# EAGLE design Pro_RF (EAGLE 9.1.0)
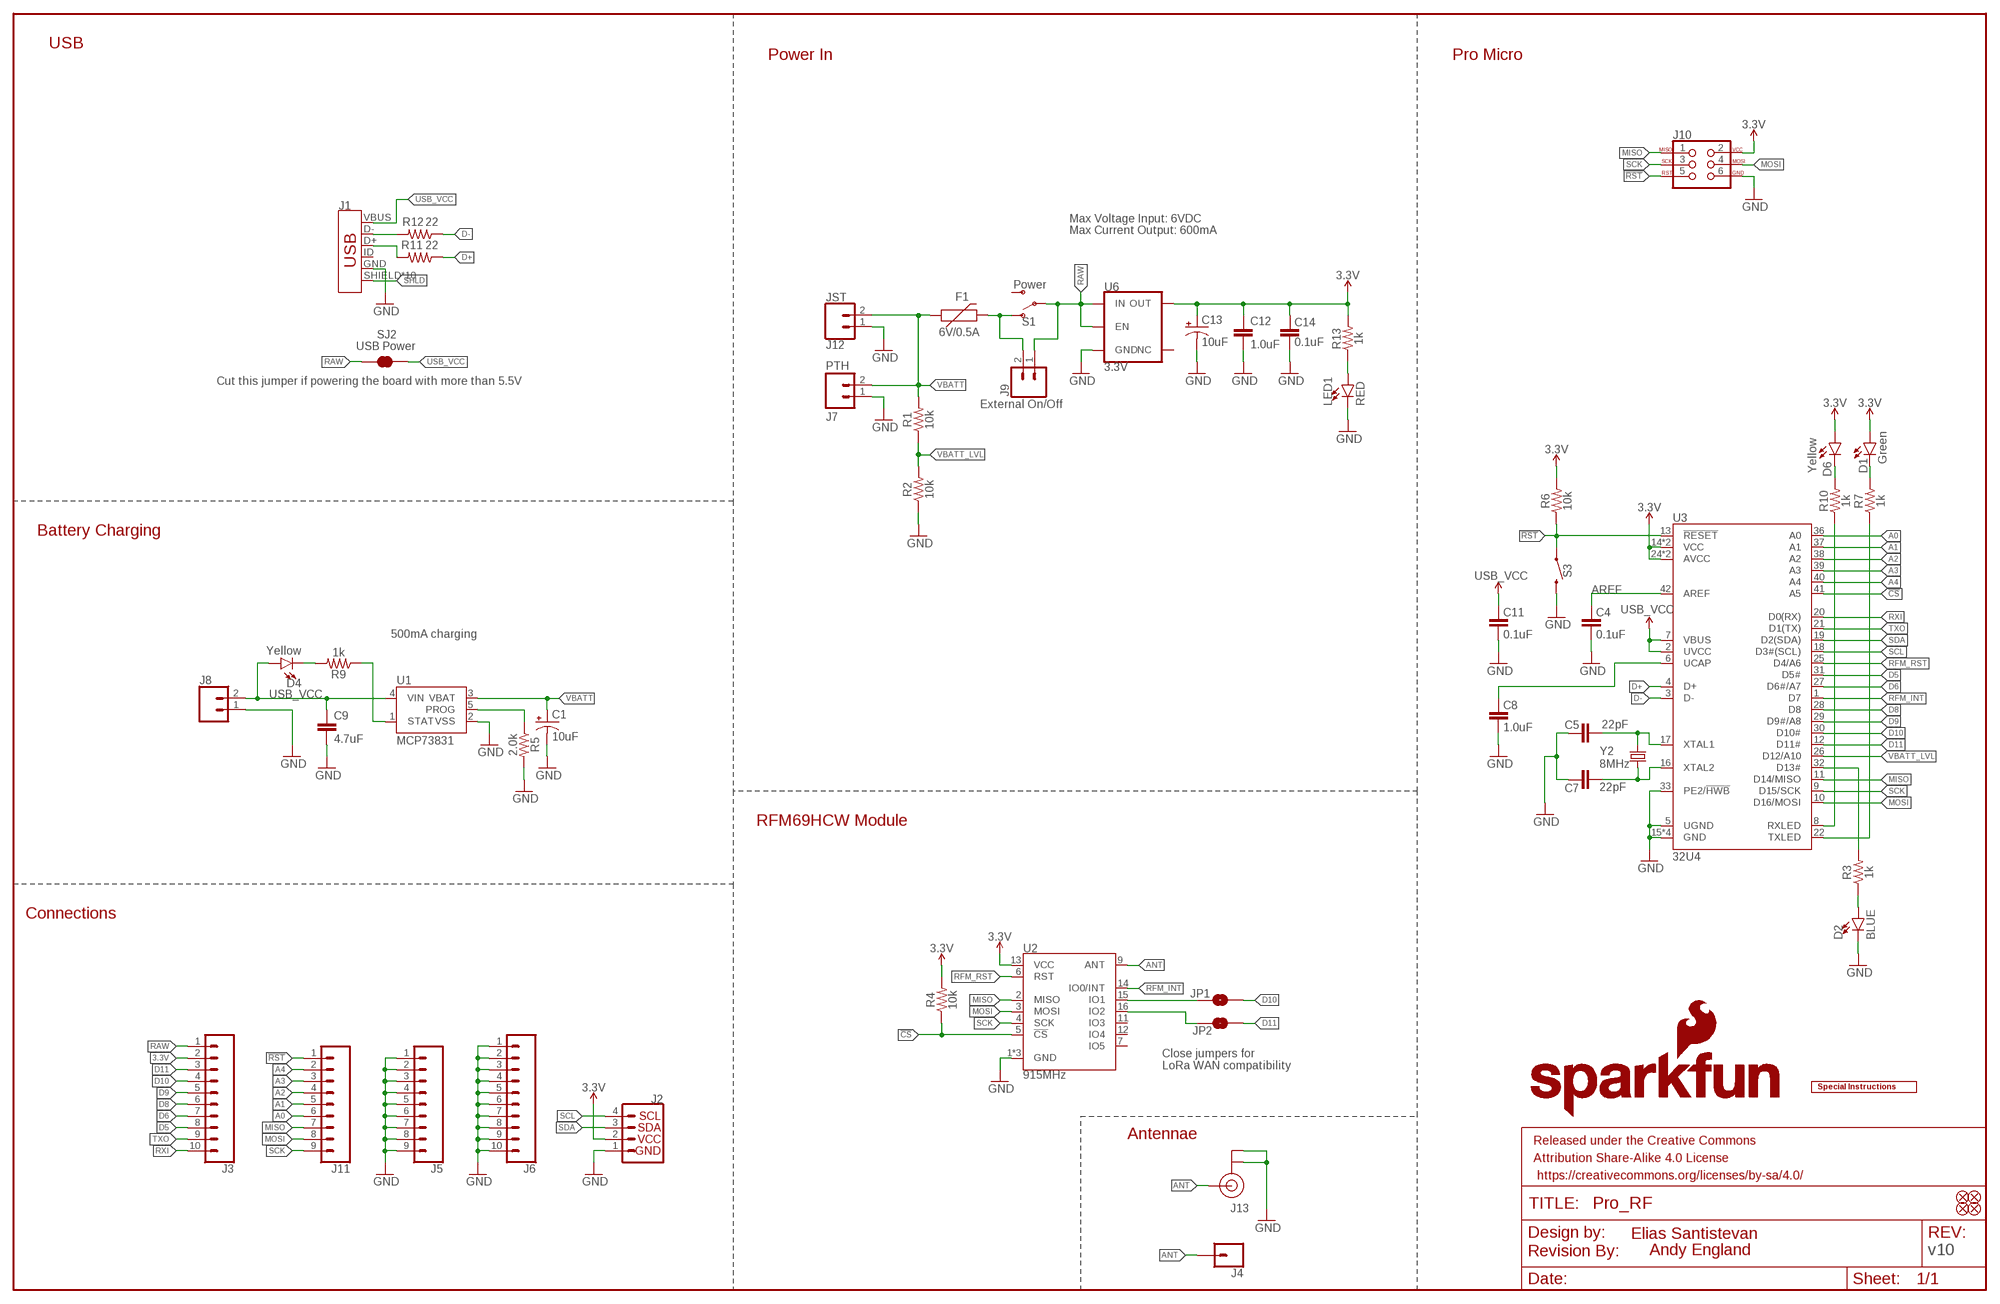
[diagram p0: schematic, sheet 1]

## Parts
C1  10uF  10UF-POLAR-EIA3216-16V-10%(TANT)  [EIA3216]
C4  0.1uF  0.1UF-0603-25V-(+80/-20%)  [0603]
C5  22pF  22PF-0603-50V-5%  [0603]
C7  22pF  22PF-0603-50V-5%  [0603]
C8  1.0uF  1.0UF-0603-16V-10%  [0603]
C9  4.7uF  4.7UF-0603-6.3V-(10%)  [0603]
C11  0.1uF  0.1UF-0603-25V-(+80/-20%)  [0603]
C12  1.0uF  1.0UF-0603-16V-10%  [0603]
C13  10uF  10UF-POLAR-EIA3216-16V-10%(TANT)  [EIA3216]
C14  0.1uF  0.1UF-0603-25V-(+80/-20%)  [0603]
D1  Green  LED-GREEN0603  [LED-0603]
D2  BLUE  LED-BLUE0603  [LED-0603]
D4  Yellow  LED-YELLOW0603  [LED-0603]
D6  Yellow  LED-YELLOW0603  [LED-0603]
F1  6V/0.5A  PPTC_HALF-AMP  [1206]
FD1  FIDUCIAL1X2  [FIDUCIAL-1X2]
FD2  FIDUCIAL1X2  [FIDUCIAL-1X2]
FD3  FIDUCIAL1X2  [FIDUCIAL-1X2]
FD4  FIDUCIAL1X2  [FIDUCIAL-1X2]
FRAME2  FRAME-LEDGER  [CREATIVE_COMMONS]
J1  USB_MICRO-B_HALF_PTH_MILL  [USB-MICROB-PTH-MILL]
J2  QWIIC_CONNECTORJS-1MM  [1X04_1MM_RA]
J3  CONN_10NO_SILK_PTH_FEMALE  [1X10_NO_SILK]
J4  CONN_01PTH_NO_SILK_YES_STOP  [1X01_NO_SILK]
J5  CONN_09NO_SILK  [1X09_NO_SILK]
J6  CONN_10NO_SILK_PTH_FEMALE  [1X10_NO_SILK]
J7  PTH  CONN_021X02_NO_SILK  [1X02_NO_SILK]
J8  CONN_021X02_NO_SILK  [1X02_NO_SILK]
J9  External On/Off  CONN_021X02_NO_SILK  [1X02_NO_SILK]
J10  AVR_SPI_PROG_3X2TESTPOINTS  [2X3_TEST_POINTS]
J11  CONN_09NO_SILK  [1X09_NO_SILK]
J12  JST  CONN_02-JST-2MM-SMT  [JST-2-SMD]
J13  U.FL  [U.FL]
JP1  JUMPER-SMT_2_NO_SILK  [SMT-JUMPER_2_NO_SILK]
JP2  JUMPER-SMT_2_NO_SILK  [SMT-JUMPER_2_NO_SILK]
LED1  RED  LED-RED0603  [LED-0603]
LOGO1  REVISION  [REVISION]
LOGO2  SFE_LOGO_NAME.1_INCH  [SFE_LOGO_NAME_.1]
LOGO3  SFE_LOGO_NAME_FLAME.1_INCH  [SFE_LOGO_NAME_FLAME_.1]
R1  10k  10KOHM-0603-1/10W-1%  [0603]
R2  10k  10KOHM-0603-1/10W-1%  [0603]
R3  1k  1KOHM-0603-1/10W-1%  [0603]
R4  10k  10KOHM-0603-1/10W-1%  [0603]
R5  2.0k  2.0KOHM-0603-1/10W-5%  [0603]
R6  10k  10KOHM-0603-1/10W-1%  [0603]
R7  1k  1KOHM-0603-1/10W-1%  [0603]
R9  1k  1KOHM-0603-1/10W-1%  [0603]
R10  1k  1KOHM-0603-1/10W-1%  [0603]
R11  22  22OHM-0603-1/10W-1%  [0603]
R12  22  22OHM-0603-1/10W-1%  [0603]
R13  1k  1KOHM-0603-1/10W-1%  [0603]
S1  Power  SWITCH-SPDT-SMD-RIGHT-ANGLE  [SWITCH_SPST_SMD_A]
S3  MOMENTARY-SWITCH-SPST-SMD-RIGHT-ANGLE  [TACTILE_SWITCH_SMD_RIGHT_ANGLE]
SJ2  USB Power  JUMPER-SMT_2_NC_TRACE_SILK  [SMT-JUMPER_2_NC_TRACE_SILK]
U1  MCP73831  [SOT23-5]
U2  915MHz  RFM69HCW-915  [RFM69HCW-XXXS2]
U3  32U4  ATMEGA32U4-ARDUINOQFN2  [QFN-44-NOPAD]
U6  3.3V  V_REG_AP2112K-3.3V  [SOT23-5]
U$26  SPECIAL_INSTRUCTIONS-ORDERING  [ORDERING_INSTRUCTIONS]
Y2  8MHz  CRYSTAL-8MHZSMD-5X3.2  [CRYSTAL-SMD-5X3.2-4PAD]

## Nets
3.3V [vcc]: C12.1 C13.+ C14.2 D1.A D6.A J2.2 J3.2 J10.2 R4.2 R6.2 R13.2 U2.13(VCC) U3.14(VCC) U3.24(AVCC) U3.34(VCC) U3.44(AVCC) U6.5(OUT)
!CS: R4.1 U2.5(!CS) U3.41(A5)
!RST: J10.5 J11.1 R6.1 S3.1 U3.13(!RESET)
A0: J11.6 U3.36(A0)
A1: J11.5 U3.37(A1)
A2: J11.4 U3.38(A2)
A3: J11.3 U3.39(A3)
A4: J11.2 U3.40(A4)
ANT: J4.1 J13.FEED(SIGNAL) U2.9(ANT)
AREF: C4.2 U3.42(AREF)
CHARGE_STAT: R9.1 U1.1(STAT)
D5: J3.8 U3.31(D5#)
D6: J3.7 U3.27(D6#/A7)
D8: J3.6 U3.28(D8)
D9: J3.5 U3.29(D9#/A8)
D10: J3.4 JP1.2 U3.30(D10#)
D11: J3.3 JP2.2 U3.12(D11#)
D+: R11.1 U3.4(D+)
D-: R12.1 U3.3(D-)
GND: C1.- C4.1 C5.2 C7.2 C8.1 C9.2 C11.1 C12.2 C13.- C14.1 D2.C J1.GND J2.1 J5.1 J5.2 J5.3 J5.4 J5.5 J5.6 J5.7 J5.8 J5.9 J6.1 J6.2 J6.3 J6.4 J6.5 J6.6 J6.7 J6.8 J6.9 J6.10 J7.1 J8.1 J10.6 J12.1 J13.1(GND) J13.2(GND) LED1.C R2.1 R5.2 S3.2 U1.2(VSS) U2.1(GND) U2.8(GND) U2.10(GND) U3.5(UGND) U3.15(GND) U3.23(GND) U3.33(PE2/!HWB) U3.35(GND) U3.43(GND) U6.2(GND)
MISO: J10.1 J11.7 U2.2(MISO) U3.11(D14/MISO)
MOSI: J10.4 J11.8 U2.3(MOSI) U3.10(D16/MOSI)
N$1: D6.C R10.2
N$2: D1.C R7.2
N$3: D2.A R3.1
N$4: C5.1 U3.17(XTAL1) Y2.3
N$5: J1.D+ R11.2
N$6: C7.1 U3.16(XTAL2) Y2.1
N$8: D4.C R9.2
N$9: F1.2 J9.2 S1.1(O)
N$11: R5.1 U1.5(PROG)
N$20: J1.D- R12.2
N$38: LED1.A R13.1
RAW [vcc]: J3.1 J9.1 S1.2(P) SJ2.1 U6.1(IN) U6.3(EN)
RFM_INT: U2.14(IO0/INT) U3.1(D7)
RFM_IO1: JP1.1 U2.15(IO1)
RFM_IO2: JP2.1 U2.16(IO2)
RFM_RST: U2.6(RST) U3.25(D4/A6)
RXI: J3.10 U3.20(D0(RX))
RXLED: R10.1 U3.8(RXLED)
SCK: J10.3 J11.9 U2.4(SCK) U3.9(D15/SCK)
SCL: J2.4 U3.18(D3#(SCL))
SDA: J2.3 U3.19(D2(SDA))
SHLD: J1.SHIELD J1.SHIELD2(SHIELD) J1.SHIELD3(SHIELD) J1.SHIELD4(SHIELD) J1.SHIELD5(SHIELD) J1.SHIELD6(SHIELD) J1.SHIELD7(SHIELD) J1.SHIELD8(SHIELD) J1.SHIELD9(SHIELD) J1.SHIELD10(SHIELD)
STAT: R3.2 U3.32(D13#)
TXLED: R7.1 U3.22(TXLED)
TXO: J3.9 U3.21(D1(TX))
UCAP: C8.2 U3.6(UCAP)
USB_VCC: C9.1 C11.2 D4.A J1.VBUS J8.2 SJ2.2 U1.4(VIN) U3.2(UVCC) U3.7(VBUS)
VBATT: C1.+ F1.1 J7.2 J12.2 R1.2 U1.3(VBAT)
VBATT_LVL: R1.1 R2.2 U3.26(D12/A10)
Unconnected: J1.ID S1.3(S) U2.7(IO5) U2.11(IO3) U2.12(IO4) U6.4(NC)

## Notes on the sheet
- USB
- Power In | Pro Micro
- Max Voltage Input: 6VDC
- Max Current Output: 600mA
- Cut this jumper if powering the board with more than 5.5V
- Battery Charging
- 500mA charging
- RFM69HCW Module
- Connections
- Close jumpers for
  LoRa WAN compatibility
- Antennae
- Elias Santistevan
- Andy England | v10

## Library data of the parts
C1 C13 = SparkFun-Capacitors:10UF-POLAR: 10.0µF polarized capacitors A capacitor is a passive two-terminal electrical component used to store electrical energy temporarily in an electric field.; PROD_ID: CAP-00811
C4 C11 C14 = SparkFun-Capacitors:0.1UF: 0.1µF ceramic capacitors A capacitor is a passive two-terminal electrical component used to store electrical energy temporarily in an electric field.; PROD_ID: CAP-00810
C5 C7 = SparkFun-Capacitors:22PF: 22pF ceramic capacitors A capacitor is a passive two-terminal electrical component used to store electrical energy temporarily in an electric field.; PROD_ID: CAP-07876
C8 C12 = SparkFun-Capacitors:1.0UF: 1µF ceramic capacitors A capacitor is a passive two-terminal electrical component used to store electrical energy temporarily in an electric field.; PROD_ID: CAP-00868
C9 = SparkFun-Capacitors:4.7UF: 4.7µF ceramic capacitors A capacitor is a passive two-terminal electrical component used to store electrical energy temporarily in an electric field.; PROD_ID: CAP-08280
D1 = SparkFun-LED:LED-GREEN: Green SMD LED Used in manufacturing of various products at SparkFun Packages: 0603 - SMD 0603 package [Product Link] <http://www.futureelectronics.com/en/technologies/semiconductors/optoelectronics/leds/Pages/9894312-LTST-C190GKT.aspx?CrossPart=HSMG-C190&IM=0> LilyPad 1206 - SMD1206 LilyPad package [Product Link] <http://www.futureelectronics.com/en/Technologies/Product.aspx?ProductID=IN150NGHARVATEKCORPORATION2049943&IM=0> 1206 - SMD1206 package [Product Link] <http://www.futureelectronics.com/en/technologies/semiconductors/optoelectronics/leds/Pages/8315665-LTST-C150KGKT.aspx?IM=0> 1206 Bottom Mount -SMD 1206 Bottom Mount [Product Link] <http://www.digikey.com/product-detail/en/lite-on-inc/LTST-C230KGKT/160-1456-1-ND/386854> SparkFun Products: Pro Mini 328 -5V <https://www.sparkfun.com/products/821> RedBoard <https://www.sparkfun.com/products/12757> MP3 Trigger <https://www.sparkfun.com/products/13720> Makey Makey <https://www.sparkfun.com/products/11076>; PROD_ID: DIO-00821; VALUE: GREEN
D2 = SparkFun-LED:LED-BLUE: Blue SMD LED Used in manufacturing of various products at SparkFun Packages: 0603 - SMD 0603 package [Product Link] <http://www.digikey.com/product-detail/en/SMLE12BC7TT86/511-1589-2-ND/1641808> 1206 - SMD1206 package [Product Link] <http://www.digikey.com/product-detail/en/lite-on-inc/LTST-C150TBKT/160-1643-1-ND/573584> SparkFun Products: ESP8266 Thing-Dev Board <https://www.sparkfun.com/products/13711> RedBoard <https://www.sparkfun.com/products/12757>; PROD_ID: DIO-08575
D4 D6 = SparkFun-LED:LED-YELLOW: Yellow SMD LED Used in manufacturing several products at SparkFun. Packages: 0603 - SMD 0603 package[Product Link] <http://www.kingbrightusa.com/product.asp?catalog_name=LED&product_id=APT1608SYCK> 0603 -SMART - SMART SMD 0603 package (more efficient/more expensive) [Product Link] <http://www.osram-os.com/osram_os/en/products/product-catalog/led-light-emitting-diodes/smartled-0603/ly-l29k/index.jsp> LilyPad - SMD1206 package[Product Datasheet] <https://www.sparkfun.com/datasheets/DevTools/LilyPad/Q150YUS4.pdf> SparkFun Products: Blynk Board <https://www.sparkfun.com/products/13794> IOIO-OTG <https://www.sparkfun.com/products/13613> XBee Explorer Serial <https://www.sparkfun.com/products/13225>; PROD_ID: DIO-09003
F1 = SparkFun-Fuses:PPTC: Resettable Fuse PPTC Resettable Fuse. Really a sort of resistor with a polymeric positive temperature coefficient whose resistance increases dramatically with an increase in temperature. When heated by the power passing through the resistance rises causing the current to be limited, protecting the circuit. This is achieved by the transition of the polymer from a crystalline to an amorphous state where the conductive carbon separates breaking the conductive pathways found in the cool crystalline structure. When a PPTC cools back down it resumes conducting letting the circuit turn back on. SparkFun Products: SparkFun RedBoard - Programmed with Arduino Pro Micro - 5V/16MHz Arduino Pro 328 - 5V/16MHz MP3 Trigger; PROD_ID: RES-08585
FD1-FD4 = SparkFun-Aesthetics:FIDUCIAL: Fiducial Alignment Points Point-of-reference for pick-and-place machines and other optical instruments.
FRAME2 = SparkFun-Aesthetics:FRAME-LEDGER: Schematic Frame - Ledger Standard 11x14 US Ledger frame
J1 = SparkFun-Connectors:USB_MICRO-B: USB Type Micro-B Connector Male/female and PTH/SMT variants SparkFun Products: SparkFun microB USB Breakout <https://www.sparkfun.com/products/12035> SparkFun USB microB Plug Breakout <https://www.sparkfun.com/products/10031> SparkFun ESP8266 Thing <https://www.sparkfun.com/products/13231>; PROD_ID: CONN-13711
J2 = SparkFun-Connectors:QWIIC_CONNECTOR: SparkFun I2C Standard Qwiic Connector An SMD 1mm pitch JST connector makes it easy and quick (get it? Qwiic?) to connect I2C devices to each other. The Qwiic system <http://www.sparkfun.com/qwiic> enables fast and solderless connection between popular platforms and various sensors and actuators. We carry 200mm <https://www.sparkfun.com/products/14204>, 100mm <https://www.sparkfun.com/products/14205>, 50mm <https://www.sparkfun.com/products/14206>, and breadboard friendly <https://www.sparkfun.com/products/14207> Qwiic cables. We also offer 10 pcs strips <https://www.sparkfun.com/products/14323> the SMD connectors.; PROD_ID: CONN-13694
J3 J6 = SparkFun-Connectors:CONN_10: Multi connection point. Often used as Generic Header-pin footprint for 0.1 inch spaced/style header connections On any of the 0.1 inch spaced packages, you can populate with these: Break Away Headers - Straight (PRT-00116) Break Away Male Headers - Right Angle (PRT-00553) Female Headers (PRT-00115) Break Away Headers - Machine Pin (PRT-00117) Break Away Female Headers - Swiss Machine Pin (PRT-00743) Arduino Stackable Header - 10 Pin (PRT-11376) For SCREWTERMINALS and SPRING TERMINALS visit here: Screw Terimnals on SparkFun.com (5mm/3.5mm/2.54mm spacing) This device is also useful as a general connection point to wire up your design to another part of your project. Our various solder wires solder well into these plated through hole pads. Hook-Up Wire - Assortment (Stranded, 22 AWG) (PRT-11375) Hook-Up Wire - Assortment (Solid Core, 22 AWG) (PRT-11367) View the entire wire category on our website here Special notes: Molex polarized connector foot print use with SKU : PRT-08231 with associated crimp pins and housings. 1MM SMD Version SKU: PRT-10208 NOTES ON THE VARIANTS LOCK and LOCK_LONGPADS... This footprint was designed to help hold the alignment of a through-hole component (i.e. 6-pin header) while soldering it into place. You may notice that each hole has been shifted either up or down by 0.005 of an inch from it's more standard position (which is a perfectly straight line). This slight alteration caused the pins (the squares in the middle) to touch the edges of the holes. Because they are alternating, it causes a "brace" to hold the component in place. 0.005 has proven to be the perfect amount of "off-center" position when using our standard breakaway headers. Although looks a little odd when you look at the bare footprint, once you have a header in there, the alteration is very hard to notice. Also,if you push a header all the way into place, it is covered up entirely on the bottom side.; PROD_ID: CONN-11563
J4 = SparkFun-Connectors:CONN_01: Single connection point. Often used as Generic Header-pin footprint for 0.1 inch spaced/style header connections On any of the 0.1 inch spaced packages, you can populate with these: Break Away Headers - Straight (PRT-00116) Break Away Male Headers - Right Angle (PRT-00553) Female Headers (PRT-00115) Break Away Headers - Machine Pin (PRT-00117) Break Away Female Headers - Swiss Machine Pin (PRT-00743) This device is also useful as a general connection point to wire up your design to another part of your project. Our various solder wires solder well into these plated through hole pads. Hook-Up Wire - Assortment (Stranded, 22 AWG) (PRT-11375) Hook-Up Wire - Assortment (Solid Core, 22 AWG) (PRT-11367) View the entire wire category on our website here Special notes: SMTSO-256-ET is a "flush mount" nut for a 4-40 screw. We mostly use this on specialty testbeds; it is a nice way to connect hardware to your PCB at an adjustable hieght. Also note, the SNAP packages are for using a snappable style connector. We sell a baggie of snaps and they are also used on two LilyPad designs: Snap Assortment - 30 pack (male and female) (DEV-11347) LilyPad Arduino SimpleSnap (DEV-10941) LilyPad SimpleSnap Protoboard (DEV-10940)
J5 J11 = SparkFun-Connectors:CONN_09: Multi connection point. Often used as Generic Header-pin footprint for 0.1 inch spaced/style header connections On any of the 0.1 inch spaced packages, you can populate with these: Break Away Headers - Straight (PRT-00116) Break Away Male Headers - Right Angle (PRT-00553) Female Headers (PRT-00115) Break Away Headers - Machine Pin (PRT-00117) Break Away Female Headers - Swiss Machine Pin (PRT-00743) For SCREWTERMINALS and SPRING TERMINALS visit here: Screw Terimnals on SparkFun.com (5mm/3.5mm/2.54mm spacing) This device is also useful as a general connection point to wire up your design to another part of your project. Our various solder wires solder well into these plated through hole pads. Hook-Up Wire - Assortment (Stranded, 22 AWG) (PRT-11375) Hook-Up Wire - Assortment (Solid Core, 22 AWG) (PRT-11367) View the entire wire category on our website here Special notes: Molex polarized connector foot print use with SKU : PRT-08231 with associated crimp pins and housings. 1MM SMD Version SKU: PRT-10208 NOTES ON THE VARIANTS LOCK and LOCK_LONGPADS... This footprint was designed to help hold the alignment of a through-hole component (i.e. 6-pin header) while soldering it into place. You may notice that each hole has been shifted either up or down by 0.005 of an inch from it's more standard position (which is a perfectly straight line). This slight alteration caused the pins (the squares in the middle) to touch the edges of the holes. Because they are alternating, it causes a "brace" to hold the component in place. 0.005 has proven to be the perfect amount of "off-center" position when using our standard breakaway headers. Although looks a little odd when you look at the bare footprint, once you have a header in there, the alteration is very hard to notice. Also,if you push a header all the way into place, it is covered up entirely on the bottom side.
J7-J9 = SparkFun-Connectors:CONN_02: Multi connection point. Often used as Generic Header-pin footprint for 0.1 inch spaced/style header connections On any of the 0.1 inch spaced packages, you can populate with these: Break Away Headers - Straight (PRT-00116) Break Away Male Headers - Right Angle (PRT-00553) Female Headers (PRT-00115) Break Away Headers - Machine Pin (PRT-00117) Break Away Female Headers - Swiss Machine Pin (PRT-00743) For SCREWTERMINALS and SPRING TERMINALS visit here: Screw Terimnals on SparkFun.com (5mm/3.5mm/2.54mm spacing) This device is also useful as a general connection point to wire up your design to another part of your project. Our various solder wires solder well into these plated through hole pads. Hook-Up Wire - Assortment (Stranded, 22 AWG) (PRT-11375) Hook-Up Wire - Assortment (Solid Core, 22 AWG) (PRT-11367) View the entire wire category on our website here Special notes: Molex polarized connector foot print use with: PRT-08233 with associated crimp pins and housings. 2.54_SCREWTERM for use with PRT-10571. 3.5mm Screw Terminal footprints for PRT-08084 5mm Screw Terminal footprints for use with PRT-08432
J10 = SparkFun-Connectors:AVR_SPI_PROG_3X2: AVR ISP 6 Pin This is the reduced ISP connector for AVR programming. Common on Arduino. This footprint will take up less PCB space and can be used with a 10-pin to 6-pin adapter such as SKU: BOB-08508 **Special note about "TEST_POINT" package. The stop mask is on the top side, so if you want your programming test points to be on the bottom of your board, make sure to place this package on the bottom side of the board. This also ensure that the orientation to program from the bottom side will be correct. SparkFun Products: SparkFun ISP Pogo Adapter - NS Tiny AVR Programmer -PTH
J12 = SparkFun-Connectors:CONN_02: Multi connection point. Often used as Generic Header-pin footprint for 0.1 inch spaced/style header connections On any of the 0.1 inch spaced packages, you can populate with these: Break Away Headers - Straight (PRT-00116) Break Away Male Headers - Right Angle (PRT-00553) Female Headers (PRT-00115) Break Away Headers - Machine Pin (PRT-00117) Break Away Female Headers - Swiss Machine Pin (PRT-00743) For SCREWTERMINALS and SPRING TERMINALS visit here: Screw Terimnals on SparkFun.com (5mm/3.5mm/2.54mm spacing) This device is also useful as a general connection point to wire up your design to another part of your project. Our various solder wires solder well into these plated through hole pads. Hook-Up Wire - Assortment (Stranded, 22 AWG) (PRT-11375) Hook-Up Wire - Assortment (Solid Core, 22 AWG) (PRT-11367) View the entire wire category on our website here Special notes: Molex polarized connector foot print use with: PRT-08233 with associated crimp pins and housings. 2.54_SCREWTERM for use with PRT-10571. 3.5mm Screw Terminal footprints for PRT-08084 5mm Screw Terminal footprints for use with PRT-08432; PROD_ID: CONN-11443
J13 = SparkFun-Connectors:U.FL: SMD Antenna Connector - U.FL 2mm height, 3.0mm x 3.0mm receptacle size. SparkFun Products: SparkFun WiFi Shield - ESP8266 <https://www.sparkfun.com/products/13287> SparkFun ESP8266 Thing <https://www.sparkfun.com/products/13231> SparkFun MiniGen - Pro Mini Signal Generator Shield <https://www.sparkfun.com/products/11420>; PROD_ID: CONN-09193; SF_ID: WRL-09144
JP1 JP2 = SparkFun-Jumpers:JUMPER-SMT_2_NO: Normally open jumper This jumper has two pads in close proximity to each other. Apply solder to close the connection. Round pads are easier to solder for beginners, but are a lot larger. SparkFun Product that uses the round pads: SparkFun EL Sequencer
LED1 = SparkFun-LED:LED-RED: Red SMD LED Used in manufacturing of most products at SparkFun Packages: 0603 - SMD 0603 package [Product Link] <http://docs.avagotech.com/docs/AV02-0551EN> 0603 SMART - SMD 0603 SMART package ( more efficient and expensive)[Product Link] <http://www.osram-os.com/Graphics/XPic2/00077099_0.pdf> 1206 - SMD1206 package [Product Link] <https://www.sparkfun.com/datasheets/DevTools/LilyPad/Q150OVS4.pdff> SparkFun Products: Pro Mini 328 -5V <https://www.sparkfun.com/products/821> RedBoard <https://www.sparkfun.com/products/12757> IOIO-OTG <https://www.sparkfun.com/products/13613>; PROD_ID: DIO-00819
LOGO1 = SparkFun-Aesthetics:REVISION: "Revision By" Text Preceding text for revisor documentation. Includes schematic text on "symbols" layer, and board text on tDoc.
LOGO2 = SparkFun-Aesthetics:SFE_LOGO_NAME: SparkFun Font Logo This is the SparkFun name logo. The logo on the schematic will always be the same size; the package variant is the height of the flame part of the logo (or the height the flame would be, if it were drawn). Default layer for the logo on the board is tSilk.
LOGO3 = SparkFun-Aesthetics:SFE_LOGO_NAME_FLAME: SparkFun Font Logo w/ Flame This is the SparkFun full logo. The logo on the schematic will always be the same size; the package variant is the height of the flame part of the logo. Default layer for the logo on the board is tSilk.
R1 R2 R4 R6 = SparkFun-Resistors:10KOHM: 10kΩ resistor A resistor is a passive two-terminal electrical component that implements electrical resistance as a circuit element. Resistors act to reduce current flow, and, at the same time, act to lower voltage levels within circuits. - Wikipedia; PROD_ID: RES-00824
R3 R7 R9 R10 R13 = SparkFun-Resistors:1KOHM: 1kΩ resistor A resistor is a passive two-terminal electrical component that implements electrical resistance as a circuit element. Resistors act to reduce current flow, and, at the same time, act to lower voltage levels within circuits. - Wikipedia; PROD_ID: RES-07856
R5 = SparkFun-Resistors:2.0KOHM: 2kΩ resistor A resistor is a passive two-terminal electrical component that implements electrical resistance as a circuit element. Resistors act to reduce current flow, and, at the same time, act to lower voltage levels within circuits. - Wikipedia; PROD_ID: RES-08296
R11 R12 = SparkFun-Resistors:22OHM: 22Ω resistor A resistor is a passive two-terminal electrical component that implements electrical resistance as a circuit element. Resistors act to reduce current flow, and, at the same time, act to lower voltage levels within circuits. - Wikipedia; PROD_ID: RES-08698
S1 = SparkFun-Switches:SWITCH-SPDT: Single Pole, Double Throw (SPDT) Switch Single-pole, double-throw (SPDT) switch. Variant Overview SMD-AYZ0202 Surface Mount DPDT Switch (COM-00597) Used on e.g. LilyPad Arduino USB - ATmega32U4 Board PTH-11.6X4.0MM SPDT Mini Power Switch (COM-00102) Used on e.g. SparkFun Simon Says - Through-Hole Soldering Kit (KIT-10547) PTH-11.6X4.0MM-KIT KIT version of SPDT Mini Power Switch - Simplifies soldering by removing tStop of switch pins - only one side can be soldered. PTH-11.6X4.0MM-LOCK LOCK version of SPDT Mini Power Switch - Offset pins hold switch in place for easier soldering. SMD-RIGHT-ANGLE Surface Mount Right Angle Switch (COM-10860) Used on e.g. SparkFun ESP8266 Thing; PROD_ID: SWCH-10651; SF_SKU: COM-10860
S3 = SparkFun-Switches:MOMENTARY-SWITCH-SPST: Momentary Switch (Pushbutton) - SPST Normally-open (NO) SPST momentary switches (buttons, pushbuttons). Variants PTH-12MM - 12mm square, through-hole Momentary Pushbutton Switch - 12mm Square (COM-09190) PTH-6.0MM, PTH-6.0MM-KIT - 6.0mm square, through-hole Mini Pushbutton Switch (COM-00097) KIT package intended for soldering kit's - only one side of pads' copper is exposed. PTH-RIGHT-ANGLE-KIT - Right-angle, through-hole Right Angle Tactile Button - Used on SparkFun BigTime Watch Kit SMD-12MM - 12mm square, surface-mount Tactile Button - SMD (12mm) (COM-12993) Used on SparkFun PicoBoard SMD-4.5MM - 4.5mm Square Trackball Switch Used on SparkFun Blackberry Trackballer Breakout SMD-4.6MMX2.8MM - 4.60mm x 2.80mm, surface mount Used on SparkFun SAMD21 Mini Breakout SMD-5.2MM, SMD-5.2-REDUNDANT - 5.2mm square, surface-mount Mini Pushbutton Switch - SMD (COM-08720) Used on Arduino Pro Mini REDUNDANT package connects both switch circuits together SMD-6.0X3.5MM - 6.0 x 3.5mm, surface mount Momentary Reset Switch SMD (COM-08229) SMD-6.2MM-TALL - 6.2mm square, surface mount Tactile Button - SMD (6mm) Used on SparkFun Digital Sandbox SMD-RIGHT-ANGLE - Right-angle, surface mount Used on SparkFun Block for Intel® Edison - Arduino; PROD_ID: COMP-12265
SJ2 = SparkFun-Jumpers:JUMPER-SMT_2_NC_TRACE: Normally closed trace jumper This jumper has a trace between two pads so it's normally closed (NC). Use a razor knife to open the connection. For best results follow the IPC guidelines for cutting traces: Cutout at least 0.063 mm (0.005 in). Remove all loose material to clean up the cut area. Seal the cut with an approved epoxy. Reapply solder to reclose the connection.
U1 = SparkFun-IC-Power:MCP73831: MCP73831T Li-Ion, Li-Pol Controller Miniature single cell, fully integrated Li-Ion, Li-polymer charge management controller Datasheet <http://ww1.microchip.com/downloads/en/DeviceDoc/20001984g.pdf> SparkFun Products: SparkFun ESP32 Thing <https://www.sparkfun.com/products/13907> SparkFun 9DoF Razor IMU M0 <https://www.sparkfun.com/products/14001>; PROD_ID: IC-09995
U2 = SparkFun-RF:RFM69H: Hope RF RFM69H ISM Transceiver Module The RFM69H is a transceiver module capable of operation over a wide frequency range, including the 315,433,868 and 915MHz license-free ISM (Industry Scientific and Medical) frequency bands. All major RF communication parameters are programmable and most of them can be dynamically set. The RFM69H offers the unique advantage of programmable narrow-band and wide- band communication modes. The RFM69H is optimized for low power consumption while offering high RF output power and channelized operation.Compliance ETSI and FCC regulations. Datasheet SparkFun Products RFM69HCW Wireless Transceiver - 915MHz (COM-13909) RFM69HCW Wireless Transceiver - 434MHz (COM-13910) SparkFun RFM69 Breakout (915MHz) (WRL-12775) SparkFun RFM69 Breakout (434MHz) (WRL-12823); PROD_ID: IC-11997
U3 = SparkFun-IC-Microcontroller:ATMEGA32U4-ARDUINO: Atmel MCU, 32KByte Atmel 44-pin 8-bit Microcontroller with 32KBytes of ISP Flash and USB Controller Datasheet SparkFun Products LilyPad Arduino USB - ATmega32U4 Board (DEV-12049) Pro Micro - 5V/16MHz (DEV-12640) Pro Micro - 3.3V/8MHz (DEV-12587) Fio v3 - ATmega32U4 (DEV-11520) Qduino Mini (DEV-13614) Makey Makey - Standard Kit (WIG-11511) Makey Makey Deluxe Kit (WIG-11519); PROD_ID: IC-10828
U6 = SparkFun-IC-Power:V_REG_AP2112: AP2112 - 600mA CMOS LDO Regulator w/ Enable The AP2112 is CMOS process low dropout linear regulator with enable function, the regulator delivers a guaranteed 600mA (min.) continuous load current. Features Output Voltage Accuracy: ±1.5% Output Current: 600mA (Min.) Foldback Short Current Protection: 50mA Enable Function to Turn ON/OFF VOUT Low Dropout Voltage (3.3V): 250mV (Typ.) @IOUT=600mA Excellent Load Regulation: 0.2%/A (Typ.) Excellent Line Regulation: 0.02%/V (Typ.) Low Quiescent Current: 55μA (Typ.) Low Standby Current: 0.01μA (Typ.) Low Output Noise: 50μVRMS PSRR: 100Hz -65dB, 1kHz -65dB OTSD Protection Stable with 1.0μF Flexible Cap: Ceramic, Tantalum and Aluminum Electrolytic Operation Temperature Range: -40°C to 85°C ESD: MM 400V, HBM 4000V; PROD_ID: VREG-12457
U$26 = SparkFun-Aesthetics:SPECIAL_INSTRUCTIONS: Special Ordering/Production Instructions Alert Symbol for special PCB ordering instructions or unique production process warnings. Ordering Instructions Production Instructions Types of information that should be added to box: Copper weight Soldermask color Silk color PCB thickness Number of layers PCB Standard: 1.6mm FR4 1 oz copper immersion silver plating red soldermask white silkscreen Types of information that should be added to box: Special wash requirements Depaneling instructions Humidification Glue curing Default text settings: 0.07 inch 9% ratio 50% line distance
Y2 = SparkFun-Clocks:CRYSTAL-8MHZ: 8MHz Crystal Datasheet Example <http://www.futureelectronics.com/en/technologies/electromechanical/timing-devices/crystals/Pages/6008189-ABM3B-8.000MHZ-B2-T.aspx?IM=0> Frequency: 8MHz Frequency Tolerance: ±20ppm Load Capacitance: 18pF SparkFun Products: Pro Micro -3.3V/8MHz <https://www.sparkfun.com/products/12587> WAV Trigger <https://www.sparkfun.com/products/13660>; PROD_ID: XTAL-09431

## Board
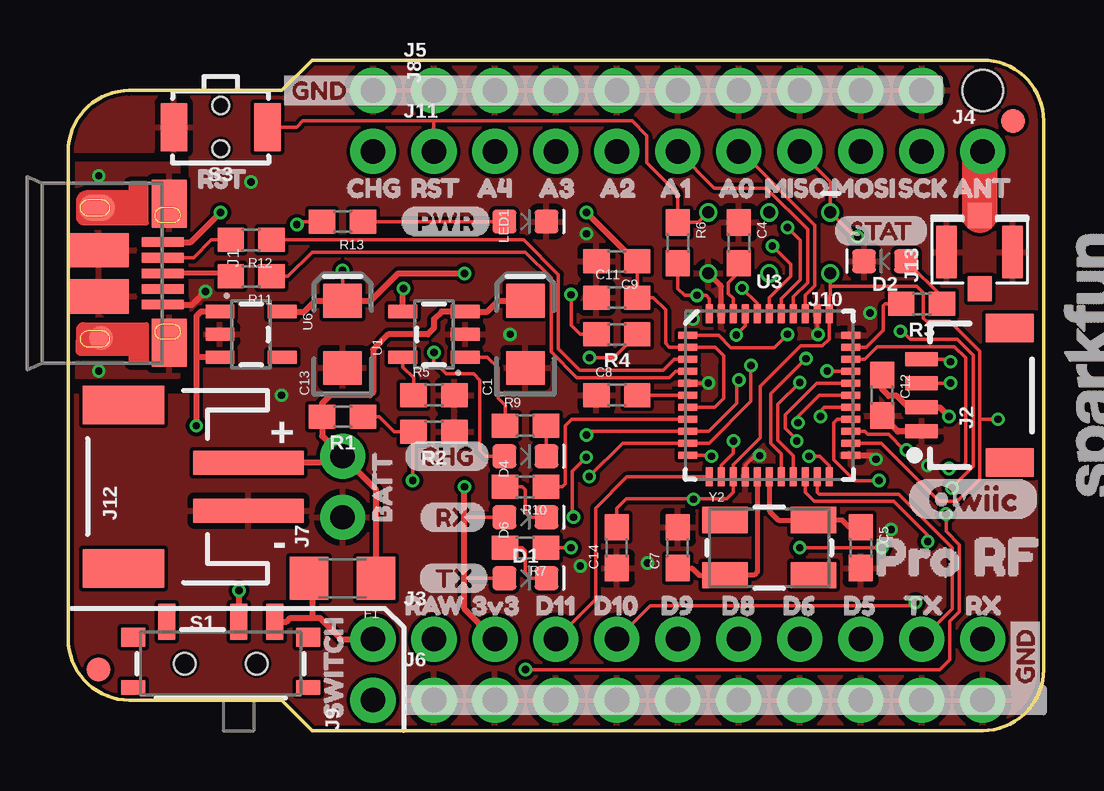
[diagram p1: board, top side]
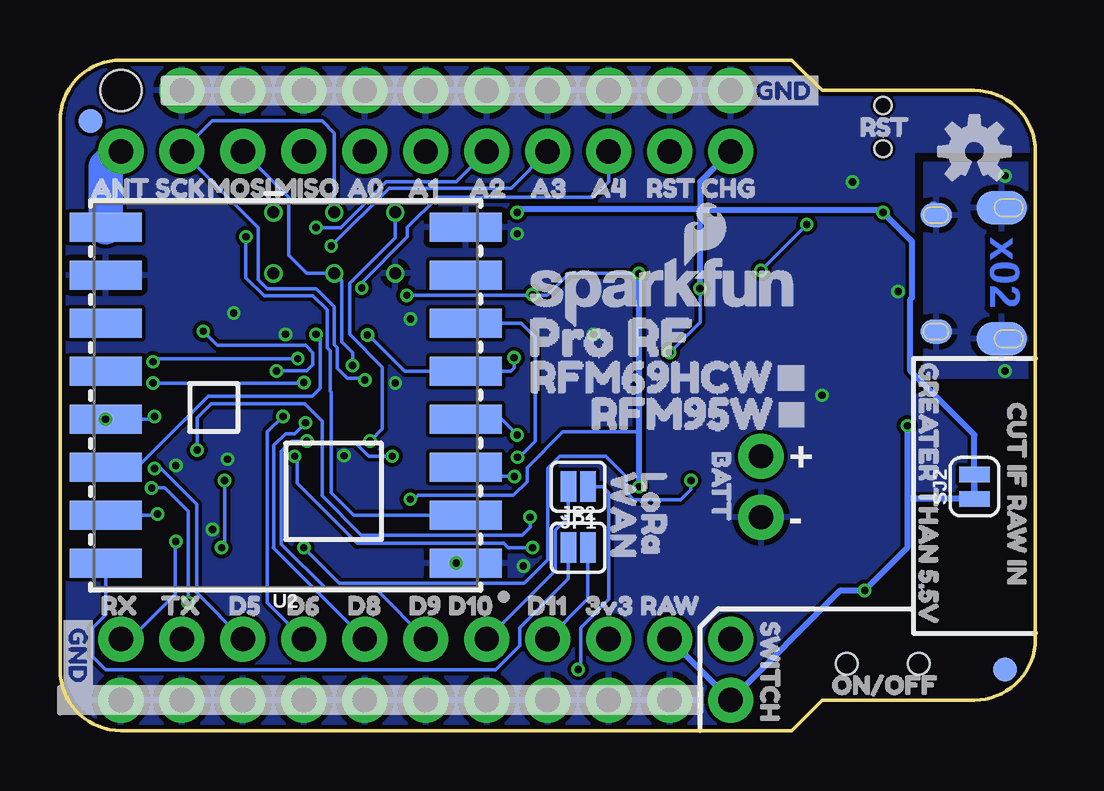
[diagram p2: board, bottom side, seen from below]

Size 40.64 x 27.94 mm. Coordinates in mm from the lower left corner, seen from the top.
Outline: 8.89,1.27 10.16,0 38.1,0 arc90 40.64,2.54 40.64,25.4 arc90 38.1,27.94 10.16,27.94 8.89,26.67 2.54,26.67 arc90 0,24.13 0,3.81 arc90 2.54,1.27 8.89,1.27
Copper layers (1*16): Top 0.035mm / dielectric 1.5mm / Bottom 0.035mm
Design rules "SparkFun-2-layer-FAB-LIMIT": minimum track width 4mil, minimum drill 6mil, track to track 4mil, track to pad 4mil, pad to pad 4mil, via to via 4mil, smd to smd 4mil, copper to edge 4mil, drill to drill 4mil, minimum pad ring 5mil, minimum via ring 5mil, stop-mask expansion 4mil, vias tented up to drill 25mil, thermal gap 10mil
Holes 1.7 mm at 38.1,26.67

### Footprints (pad centres in the part's own frame; a part is rotated, then mirrored left to right if it is on the bottom)
EIA3216 = smd 1.4 x 1.6: + 1.4,0; - -1.4,0
0603 = smd 1.1 x 1: 1 -0.85,0; 2 0.85,0
LED-0603 = smd 1 x 1: A -0.877,0; C 0.877,0
1206 = smd 1.6 x 1.8: 1 -1.4,0; 2 1.4,0
FIDUCIAL-1X2 = smd 1 x 1: 1 0,0
USB-MICROB-PTH-MILL = smd 0.4 x 1.75: D+ 0,0; D- -0.65,0; GND 1.3,0; ID 0.65,0; VBUS -1.3,0 | smd 2 x 1.46: SHIELD -2.9,0.275; SHIELD2 2.9,0.275 | smd 1.425 x 2.5: SHIELD3 -0.963,-2.675; SHIELD4 0.963,-2.675 | smd 1.4 x 2.1 bottom: SHIELD5 -2.731,-2.531; SHIELD7 2.729,-2.531 | smd 1 x 1: SHIELD6 2.7,-2.575 | smd 1.1 x 1.5: SHIELD8 -2.731,-2.731 | smd 1 x 1.3 bottom: SHIELD9 -2.43,0.195; SHIELD10 2.43,0.195
1X04_1MM_RA = smd 0.6 x 1.35: 1 -1.5,0; 2 -0.5,0; 3 0.5,0; 4 1.5,0 | smd 1.2 x 2: NC1 2.8,-3.675; NC2 -2.8,-3.675
1X10_NO_SILK = drill 1.016 pad 1.88: 1 0,0; 2 2.54,0; 3 5.08,0; 4 7.62,0; 5 10.16,0; 6 12.7,0; 7 15.24,0; 8 17.78,0; 9 20.32,0; 10 22.86,0
1X01_NO_SILK = drill 1.016 pad 1.88: 1 0,0
1X09_NO_SILK = drill 1.016 pad 1.88: 1 0,0; 2 2.54,0; 3 5.08,0; 4 7.62,0; 5 10.16,0; 6 12.7,0; 7 15.24,0; 8 17.78,0; 9 20.32,0
1X02_NO_SILK = drill 1.016 pad 1.88: 1 0,0; 2 2.54,0
2X3_TEST_POINTS = drill 0.508: 1 -2.54,-1.27; 2 -2.54,1.27; 3 0,-1.27; 4 0,1.27; 5 2.54,-1.27; 6 2.54,1.27
JST-2-SMD = smd 1 x 4.6: 1 -1,-3.7; 2 1,-3.7 | smd 1.6 x 3.4: NC1 -3.4,1.5; NC2 3.4,1.5
U.FL = smd 2.2 x 0.85: 1 0,1.375; 2 0,-1.375 | smd 1.05 x 1: FEED 1.525,0; NC -1.525,0
SMT-JUMPER_2_NO_SILK = smd 0.635 x 1.27: 1 -0.406,0; 2 0.406,0
SWITCH_SPST_SMD_A = smd 0.7 x 1.5: 1 -2.25,-1.75; 2 -0.75,-1.75; 3 2.25,-1.75 | smd 1 x 0.6: GND1 -3.65,1; GND3 3.65,1 | smd 1 x 0.8: GND2 -3.65,-1.1; GND4 3.65,-1.1 | hole 0.9: -1.5,0; 1.5,0
TACTILE_SWITCH_SMD_RIGHT_ANGLE = smd 1.1 x 2: 1 -1.95,0; 2 1.95,0 | hole 0.7: 0,0.9; 0,-0.9
SMT-JUMPER_2_NC_TRACE_SILK = smd 0.635 x 1.27: 1 -0.508,0; 2 0.508,0
SOT23-5 = smd 0.55 x 1.2: 1 -0.95,-1.3; 2 0,-1.3; 3 0.95,-1.3; 4 0.95,1.3; 5 -0.95,1.3
RFM69HCW-XXXS2 = smd 3 x 1.2: 1 -7.5,7; 2 -7.5,5; 3 -7.5,3; 4 -7.5,1; 5 -7.5,-1; 6 -7.5,-3; 7 -7.5,-5; 8 -7.5,-7; 9 7.5,-7; 10 7.5,-5; 11 7.5,-3; 12 7.5,-1; 13 7.5,1; 14 7.5,3; 15 7.5,5; 16 7.5,7
QFN-44-NOPAD = smd 0.8 x 0.3: 1 -3.4,2.5; 2 -3.4,2; 3 -3.4,1.5; 4 -3.4,1; 5 -3.4,0.5; 6 -3.4,0; 7 -3.4,-0.5; 8 -3.4,-1; 9 -3.4,-1.5; 10 -3.4,-2; 11 -3.4,-2.5; 23 3.4,-2.5; 24 3.4,-2; 25 3.4,-1.5; 26 3.4,-1; 27 3.4,-0.5; 28 3.4,0; 29 3.4,0.5; 30 3.4,1; 31 3.4,1.5; 32 3.4,2; 33 3.4,2.5 | smd 0.3 x 0.8: 12 -2.5,-3.4; 13 -2,-3.4; 14 -1.5,-3.4; 15 -1,-3.4; 16 -0.5,-3.4; 17 0,-3.4; 18 0.5,-3.4; 19 1,-3.4; 20 1.5,-3.4; 21 2,-3.4; 22 2.5,-3.4; 34 2.5,3.4; 35 2,3.4; 36 1.5,3.4; 37 1,3.4; 38 0.5,3.4; 39 0,3.4; 40 -0.5,3.4; 41 -1,3.4; 42 -1.5,3.4; 43 -2,3.4; 44 -2.5,3.4
CRYSTAL-SMD-5X3.2-4PAD = smd 1.9 x 1.1: 1 -1.85,-1.15; 2 1.85,-1.15; 3 1.85,1.15; 4 -1.85,1.15

### Placement (x,y rotation side)
C1  19.05,16.51 90 top
C4  27.94,20.32 270 top
C5  33.02,7.62 270 top
C7  25.4,7.62 90 top
C8  22.86,13.97 0 top
C9  22.86,19.56 180 top
C11  22.86,18.03 0 top
C12  33.91,13.97 270 top
C13  11.43,16.51 90 top
C14  22.86,7.62 90 top
D1  19.05,6.35 0 top
D2  34.04,19.56 180 top
D4  19.05,11.43 0 top
D6  19.05,8.89 0 top
F1  11.43,6.35 180 top
FD1  1.27,2.54 0 bottom
FD2  39.37,25.4 0 bottom
FD3  1.27,2.54 0 top
FD4  39.37,25.4 0 top
FRAME2  -13.97,-12.7 0 top  (outside the outline)
J1  3.94,19.05 270 top
J2  35.56,13.97 90 top
J3  15.24,3.81 0 top
J4  38.1,24.13 0 top
J5  15.24,26.67 0 top
J6  15.24,1.27 0 top
J7  11.43,8.89 90 top
J8  12.7,26.67 270 top
J9  12.7,1.27 90 top
J10  29.21,20.32 180 top
J11  15.24,24.13 0 top
J12  3.81,10.16 90 top
J13  37.97,19.94 90 top
JP1  19.05,10.16 180 bottom
JP2  19.05,7.62 0 bottom
LED1  19.05,21.21 0 top
LOGO1  -2.54,-15.24 0 top  (outside the outline)
LOGO2  44.83,9.27 90 top  (outside the outline)
LOGO3  21.46,16.76 0 bottom
R1  11.43,13.08 180 top
R2  15.24,12.45 180 top
R3  35.56,17.78 180 top
R4  22.86,16.51 180 top
R5  15.24,13.97 0 top
R6  25.4,20.32 270 top
R7  19.05,7.62 180 top
R9  19.05,12.7 0 top
R10  19.05,10.16 180 top
R11  7.62,18.92 180 top
R12  7.62,20.45 180 top
R13  11.43,21.21 180 top
S1  6.35,2.79 180 top
S3  6.35,25.15 180 top
SJ2  2.54,10.16 90 bottom
U1  15.24,16.51 90 top
U2  31.24,13.97 180 bottom
U3  29.21,13.97 0 top
U6  7.62,16.51 270 top
U$1  [PRO_RF0]  32.26,7.24 0 top
U$3  [A43]  16.38,22.61 0 top
U$4  [A34]  18.92,22.61 0 top
U$5  [A25]  21.46,22.61 0 top
U$6  [A16]  24,22.61 0 top
U$7  [A07]  26.42,22.61 0 top
U$8  [MISO8]  28.32,22.61 0 top
U$9  [MOSI9]  31.11,22.61 0 top
U$10  [SCK10]  33.91,22.61 0 top
U$11  [ANT11]  36.2,22.61 0 top
U$12  [GND0]  8.64,26.67 0 top
U$13  [RST2]  13.59,22.61 0 top
U$14  [CHG1]  10.92,22.61 0 top
U$15  [D90]  24,5.21 0 top
U$16  [D90]  26.8,5.21 0 bottom
U$17  [GND0]  39.88,4.95 270 bottom
U$18  [D615]  29.08,5.21 0 top
U$19  [RX2]  39.62,5.21 0 bottom
U$20  [D817]  26.54,5.21 0 top
U$21  [D100]  25.15,5.21 0 bottom
U$22  [D1119]  18.8,5.21 0 top
U$23  [3V320]  16.13,5.21 0 top
U$24  [RAW21]  13.34,5.21 0 top
U$25  [LORA0]  15.88,11.68 270 bottom
U$26  -34.29,-16.51 0 top  (outside the outline)
U$27  [SWITCH23]  11.05,-0.13 90 top
U$28  [RST2]  4.7,22.99 0 top
U$29  [BATT25]  13.08,8 90 top
U$31  [PRO_RF0]  22.48,16.38 0 bottom
U$32  [BATT25]  13.08,12.32 270 bottom
U$33  [CUT_IF_RAW_IN0]  0.76,14.35 270 bottom
U$34  [GREATER_THAN_5#5V1]  4.45,16 270 bottom
U$35  [WAN1]  17.14,11.68 270 bottom
U$36  [RST2]  8,25.15 0 bottom
U$37  [SWITCH23]  11.05,5.21 270 bottom
U$38  [GND0]  12.32,26.67 0 bottom
U$39  [ON#OFF0]  9.14,1.91 0 bottom
U$40  [CHG1]  14.61,22.61 0 bottom
U$41  [RST2]  16.89,22.61 0 bottom
U$42  [A43]  19.18,22.61 0 bottom
U$43  [A34]  21.72,22.61 0 bottom
U$44  [A25]  24.26,22.61 0 bottom
U$45  [A16]  26.8,22.61 0 bottom
U$46  [A07]  29.34,22.61 0 bottom
U$47  [MISO8]  32.38,22.61 0 bottom
U$48  [MOSI9]  35.18,22.61 0 bottom
U$49  [SCK10]  37.34,22.61 0 bottom
U$50  [ANT11]  40.01,22.61 0 bottom
U$51  [OSHW-LOGO-S]  2.54,24.13 0 bottom
U$52  [RAW21]  17.14,5.21 0 bottom
U$53  [3V320]  19.43,5.21 0 bottom
U$54  [D1119]  21.84,5.21 0 bottom
U$55  [D514]  31.62,5.21 0 top
U$56  [D817]  29.34,5.21 0 bottom
U$57  [TX3]  37.08,5.21 0 bottom
U$58  [D615]  31.88,5.21 0 bottom
U$59  [RFM69HCW#1]  22.23,14.73 0 bottom
U$60  [RFM95W#0]  19.68,13.21 0 bottom
U$62  [GND0]  39.88,1.27 90 top
U$63  [PWR-()-03]  13.84,21.21 0 top
U$65  [CHG1]  13.97,11.43 0 top
U$66  [QWIIC-()-04]  34.92,9.65 0 top
U$68  [D100]  21.21,5.21 0 top
U$69  [TX3]  34.16,5.21 0 top
U$70  [TX6]  14.61,6.35 0 top
U$71  [STAT5]  31.88,20.83 0 top
U$72  [RX7]  14.61,8.89 0 top
U$73  [RX2]  36.7,5.21 0 top
U$74  [D514]  34.29,5.21 0 bottom
Y2  29.21,7.62 0 top

### Tracks (layer width: path | path; a pad name or v marks a point on that pad's centre or on a via)
3.3V  (via drill 0.3)
  Top 0.152: C14.2 22.86,9.27 23.24,9.65 26.06,9.65 | U3.24 33.88,11.97 36.3,9.55 36.83,9.55 37.05,9.55 37.97,10.47 37.97,12.95 | D6.A 16.51,8.89 | D1.A 16.51,6.35 | 26.06,9.65 27.43,9.65 27.71,9.93 U3.14 27.71,11.07 28.83,12.19 28.83,14.34 30.51,16.03 31.42,16.03 31.71,16.32 U3.34 31.71,18.1 31.75,18.14 31.75,18.41 31.75,18.51 | 26.06,9.65 v26.05,9.64 | U3.44 26.71,18 26.57,18.14 v26.19,18.14 25.68,18.14 25.4,18.41 R6.2 | R13.2 9.65,21.21 v9.53,21.08 | v11.43,19.18 C13.+ | J10.2 31.75,18.51 | 31.75,18.51 35.35,18.51 35.63,18.23 35.63,17.18 35.77,17.05 36.73,17.05 37.97,15.81 37.97,12.95 | R4.2 21.34,16.51 20.95,16.89 v20.95,18.16 | U2.13 37.99,12.97 37.97,12.95
  Top 0.254: v36.7,13.08 36.31,13.47 J2.2 35,13.47 34.52,13.95 34.18,13.95 33.91,14.22 C12.1 | U6.5 9.84,17.46 10.29,17.91 C13.+ 12.6,17.91 13.74,19.05 v16.51,19.05 | J3.2 16.51,5.08 16.51,6.35 16.51,8.89 v16.51,10.16
  Bottom 0.152: v26.05,9.64 25.88,9.64 25.72,9.8 21.75,9.8 21.18,10.37 21.18,10.95 19.68,12.45 16.51,12.45 | v16.51,19.05 19.43,19.05 20.34,18.14 20.95,18.14 | 20.95,18.14 v26.19,18.14 | v9.53,21.08 v11.43,19.18 | U2.13 36.81,12.97 | v20.95,18.16 20.95,18.14
  Bottom 0.254: 36.81,12.97 v36.7,13.08 | v16.51,10.16 16.51,12.45 v16.51,19.05
  other vias: 38.74,12.97
!CS  (via drill 0.3)
  Top 0.152: U3.41 28.21,16.86 v27.84,16.49 | R4.1 22.74,15.54 v21.72,15.54
  Bottom 0.152: v27.84,16.49 27.79,16.49 26.27,14.97 U2.5 21.86,14.97 21.72,15.11 v21.72,15.54
!RST  (via drill 0.3)
  Top 0.152: U3.13 27.21,11.05 27.72,11.56 v27.72,12.06 | J11.1 15.24,25.4 | 15.24,25.4 23.5,25.4 24.11,24.79 24.11,23.65 25.4,22.36 R6.1 26.25,21.17 J10.5 | 15.24,25.4 9.78,25.4 9.53,25.15 S3.1
  Bottom 0.152: v27.72,12.06 27.21,12.57 27.21,15.14 28.57,16.51 28.57,18.63 26.67,20.54 J10.5
A0
  Top 0.152: U3.36 30.71,18.14 31.11,18.54 31.11,21.05 28.04,24.13 J11.6
A1
  Top 0.152: J11.5 26.92,22.61 29.09,22.61 30.81,20.89 30.81,18.67 30.21,18.07 U3.37
A2  (via drill 0.3)
  Top 0.152: U3.38 29.71,18 30.49,18.78 30.49,20.43 v29.97,20.95
  Bottom 0.152: J11.4 24.13,22.86 27.04,22.86 28.95,20.95 v29.97,20.95
A3  (via drill 0.3)
  Top 0.152: U3.39 29.21,18.03 30.1,18.92 30.1,19.43 v29.34,20.19
  Bottom 0.152: J11.3 21.84,22.61 26.92,22.61 v29.34,20.19
A4  (via drill 0.3)
  Top 0.152: U3.40 28.71,17.79 v28.07,18.44
  Bottom 0.152: J11.2 17.78,22.86 18.41,22.23 24.91,22.23 26.16,20.97 26.16,20.57 28.07,18.67 v28.07,18.44
ANT
  Top 1.473: J13.FEED 37.97,24 J4.1
  Bottom 1.448: J4.1 38.74,23.49 U2.9
AREF
  Top 0.152: U3.42 27.71,18 27.51,18.21 27.51,18.67 27.94,19.1 C4.2
CHARGE_STAT
  Top 0.152: U1.1 17.46,15.56 17.91,15.11 17.91,13.84 18.2,13.55 R9.1
D5  (via drill 0.3)
  Top 0.152: U3.31 33.19,15.47 33.71,16 36.92,16 37.39,15.53 37.39,11.14 37.17,10.92 v36.7,10.92
  Bottom 0.152: J3.8 34.95,5.74 34.95,9.42 36.45,10.92 v36.7,10.92
D6  (via drill 0.3)
  Top 0.152: U3.27 31.5,13.47 31.35,13.31 v31.35,13.08
  Bottom 0.152: J3.7 32,5.33 32,12.45 31.37,13.08 v31.35,13.08
D8  (via drill 0.3)
  Top 0.152: U3.28 31.3,13.97 30.41,13.08 v30.41,12.83
  Bottom 0.152: J3.6 31.75,7.62 31.73,7.64 31.73,11.89 31.24,12.37 30.86,12.37 v30.41,12.83
D9  (via drill 0.3)
  Top 0.152: U3.29 31.18,14.47 29.87,13.16 29.87,12.61 30.36,12.12 v30.36,12.06
  Bottom 0.152: J3.5 27.43,5.84 29.49,5.84 31.42,7.77 31.42,11.63 30.99,12.06 v30.36,12.06
D10  (via drill 0.3)
  Top 0.152: U3.30 31.64,14.97 v31.62,14.99 | v35.31,5.33 35.18,5.21 24.26,5.21 J3.4 | v34.67,16.64 34.75,16.64 35.08,16.3 37.04,16.3 37.72,15.63 37.72,11.01 v36.82,10.11
  Bottom 0.152: v34.67,16.64 34.09,16.05 30.4,16.05 30.1,15.75 30.1,15.24 30.35,14.99 v31.62,14.99 | JP1.2 19.46,8.9 20,8.35 20,6.67 J3.4 | v35.31,5.33 35.31,9.14 36.27,10.11 v36.82,10.11
D11
  Top 0.152: J3.3 21.97,5.46 21.97,9.27 23.27,10.57 U3.12
  Bottom 0.152: JP2.2 18.64,5.49 J3.3
D+
  Top 0.152: R11.1 9.14,18.92 10.16,19.94 19.05,19.94 20.12,18.87 20.12,15.77 21.19,14.7 25.04,14.7 25.31,14.97 U3.4
D-
  Top 0.152: U3.3 25.25,15.47 24.78,15 21.32,15 20.42,15.9 20.42,19 18.97,20.45 R12.1
GND  (via drill 0.3)
  Top 0.152: U3.35 31.21,16.54 v31.24,16.51 | U3.5 v26.66,14.47 v26.67,14.48 | U3.15 28.21,11.06 28.6,11.45 v28.81,11.45
  Top 0.203: U3.43 27.21,18.51 J10.6
  Top 0.254: J2.1 34.56,12.47 C12.2 | U3.23 33.02,11.47 33.49,11.47 v33.66,11.3 | J1.GND 5.18,17.75 v5.71,18.29
  other vias: 8.89,13.97 18.41,16.51 21.59,20.7 7.62,22.86 33.4,17.4 35.81,11.05 24.13,6.99 26.04,17.14 34.29,8.38 21.34,6.86
  pour Bottom (isolate 0.152): 0,27.94 40.64,27.94 40.64,0 0,0 0,13.97 5.08,13.97 5.08,24.13 0,24.13
  pour Top (isolate 0.152): 40.64,27.94 0,27.94 0,24.13 5.08,24.13 5.08,13.97 0,13.97 0,0 40.64,0
MISO  (via drill 0.3)
  Top 0.152: U3.11 26.76,11.47 v26.8,11.43 | J11.7 31.75,22.86 J10.1 32.77,20.57 v32.89,20.57
  Bottom 0.152: 29.34,11.94 29.34,11.23 29.34,9.91 28.4,8.97 U2.2 | 29.34,11.94 29.29,11.99 28.34,11.99 27.78,11.43 v26.8,11.43 | 29.34,11.94 29.34,14.1 29.39,14.15 29.39,15.83 29.52,15.96 29.52,17.53 30.1,18.11 32.14,18.11 32.89,18.86 v32.89,20.57
MOSI  (via drill 0.3)
  Top 0.152: v21.71,10.59 23.1,11.97 U3.10 26.7,11.97 28.45,13.72 v28.45,15.22
  Bottom 0.152: J11.8 31.11,22.23 31.11,19.81 30.35,19.05 J10.4 28.91,18.75 28.91,16.21 28.45,15.75 v28.45,15.22 | U2.3 23.36,10.59 v21.71,10.59
N$1
  Top 0.152: R10.2 18.92,10.16 19.05,10.03 19.05,9.14 19.3,8.89 D6.C
N$2
  Top 0.152: R7.2 18.92,7.62 19.05,7.49 19.05,6.6 19.3,6.35 D1.C
N$3
  Top 0.152: R3.1 36.44,17.81 36.44,18.05 34.92,19.56 D2.A
N$4
  Top 0.203: C5.1 32.55,8.47 32.25,8.77 31.24,8.77 | 31.24,8.77 Y2.3 | U3.17 29.21,9.14 29.59,8.76 29.6,8.77 31.24,8.77
N$5
  Top 0.203: R11.2 6.64,19.05 J1.D+
N$6
  Top 0.203: C7.1 26,6.77 26.29,6.48 Y2.1 28.57,6.48 28.71,6.61 U3.16
N$8
  Top 0.152: R9.2 19.93,12.67 D4.C
N$9
  Top 0.254: S1.1 9.1,4.54 9.26,4.7 10.16,4.7 | 10.16,4.7 10.49,4.7 11.38,3.81 J9.2 | F1.2 10.16,6.22 10.16,4.7
N$11
  Top 0.152: U1.5 13.94,15.14 14.39,14.69 R5.1
N$20
  Top 0.152: J1.D- 5.22,19.7 5.97,20.45 R12.2
N$38
  Top 0.152: R13.1 LED1.A
RAW  (via drill 0.3)
  Top 0.254: U6.1 5.52,17.46 5.33,17.27 5.33,15.49 | 5.33,15.49 v5.33,12.7 | U6.3 5.4,15.56 5.33,15.49 | v7.11,5.84 v7.1,5.83 S1.2
  Bottom 0.254: J3.1 J9.1 8.13,5.84 v7.11,5.84 5.33,7.62 5.33,9.65 | v5.33,12.7 5.33,9.65 | SJ2.1 5.33,9.65
RFM_INT  (via drill 0.3)
  Top 0.152: v29.97,16.51 29.42,15.95 27.61,15.95 27.1,16.47 U3.1
  Bottom 0.152: v29.97,16.51 29.79,16.33 29.79,14.26 30.14,13.92 34.29,13.92 34.47,13.92 37.42,10.97 U2.14
RFM_IO1  (via drill 0.3)
  Top 0.152: v36.58,9.02 36.58,8.3 37.13,7.75 37.13,4.95 36.73,4.55 36.73,2.95 36.32,2.54 v19.05,2.54
  Bottom 0.152: U2.15 36.62,8.97 v36.58,9.02 | v19.05,2.54 18.95,2.64 18.95,4.29 17.78,5.46 17.78,9.91 18.03,10.16 JP1.1
RFM_IO2
  Bottom 0.152: U2.16 38.74,4.82 39.27,4.29 39.27,3.07 38.73,2.54 22.48,2.54 21.49,3.53 21.49,4.29 19.46,6.33 JP2.1
RFM_RST  (via drill 0.3)
  Top 0.152: U3.25 33.19,12.47 33.31,12.34 34.19,12.34 34.84,11.68 v34.92,11.68 | v21.58,11.39 21.01,10.81 21.01,8.94 v21.06,8.89
  Bottom 0.152: U2.6 21.41,16.97 20.83,16.38 20.83,12.06 21.51,11.39 v21.58,11.39 | v34.92,11.68 34.92,13.03 34.34,13.61 30.44,13.61 29.72,12.89 29.72,9.78 28.08,8.14 21.39,8.14 21.06,8.47 v21.06,8.89
RXI  (via drill 0.3)
  Top 0.152: U3.20 30.71,9.93 31.09,9.55 34.39,9.55 35.81,8.13 v35.81,7.87
  Bottom 0.152: J3.10 37.72,3.81 35.84,5.69 35.84,7.85 v35.81,7.87
RXLED
  Top 0.152: R10.1 20.57,10.16 20.7,10.29 20.7,12.7 20.97,12.97 U3.8
SCK  (via drill 0.3)
  Top 0.152: v21.59,12.32 21.74,12.47 U3.9 26.69,12.47 27.86,13.64 27.86,14.53 v27.94,14.61
  Bottom 0.152: v21.59,12.32 22.24,12.97 U2.4 | J10.3 29.21,24.89 29.72,25.4 34.29,25.4 J11.9 32.38,20.95 32.38,18.79 32.01,18.41 29.97,18.41 29.21,17.65 29.21,16.08 29.08,15.96 29.08,15.1 28.67,14.68 28.02,14.68 v27.94,14.61
SCL  (via drill 0.3)
  Top 0.152: J2.4 36.66,15.47 v36.76,15.37 | v30.73,15.49 29.26,14.02 29.26,11.97 29.71,11.53 U3.18
  Bottom 0.152: v30.73,15.49 36.63,15.49 v36.76,15.37
SDA  (via drill 0.3)
  Top 0.152: v36.76,14.48 J2.3 | v30.48,14.5 29.57,13.59 29.57,12.1 30.21,11.46 U3.19
  Bottom 0.152: v30.48,14.5 30.5,14.48 v36.76,14.48
SHLD  (via drill 0.3)
  Bottom 0.152: J1.SHIELD9 4.13,21.91 4.19,21.97 4.32,21.97 4.13,21.79 J1.SHIELD9
  other vias: 1.27,14.99 1.27,23.11
  pour Top (isolate 0.203): 0,23.62 4.57,23.62 4.57,14.73 0,14.73
  pour Bottom (isolate 0.203): 4.57,23.62 0,23.62 0,14.73 4.57,14.73
STAT
  Top 0.152: U3.32 33.24,15.97 33.96,16.69 33.96,17.7 34.04,17.78 R3.2
TXLED  (via drill 0.3)
  Top 0.152: R7.1 v20.95,7.62 | U3.22 31.71,11.04 31.32,11.43 v30.86,11.43
  Bottom 0.152: v20.95,7.62 21.97,7.62 22.15,7.8 28.25,7.8 30.76,10.31 30.76,11.33 v30.86,11.43
TXO
  Top 0.152: U3.21 31.21,9.94 31.3,9.85 34.6,9.85 34.92,9.53 36.83,7.62 36.83,5.08 J3.9
UCAP
  Top 0.152: U3.6 C8.2
USB_VCC  (via drill 0.3)
  Top 0.152: C9.1 C11.2 24.38,18.03 24.89,17.53 24.89,16.13 25.05,15.97 U3.2 26.96,15.97 27.3,15.62 27.3,15.24 27.3,13.84 26.93,13.47 U3.7 | D4.A 17.4,11.43 17.14,11.68 17.14,14.61 16.89,14.86 15.75,14.86 15.24,15.37 v15.24,15.75
  Top 0.254: U1.4 13.94,18.39 v13.97,18.41 | v21.59,21.59 23.62,19.56 C9.1 | J1.VBUS 5.11,20.35 v6.35,21.59
  Bottom 0.152: v15.24,15.75 13.97,17.02 v13.97,18.41 | SJ2.2 2.54,10.92
  Bottom 0.254: 13.97,21.59 13.97,21.72 21.46,21.72 v21.59,21.59 | J8.2 13.97,22.86 13.97,21.69 | 13.97,21.69 6.45,21.69 v6.35,21.59 5.13,20.37 5.13,18.05 5.21,17.97 5.21,14.99 2.54,12.32 2.54,10.92 | 13.97,21.69 13.97,21.59 | v13.97,18.41 13.97,21.59
VBATT
  Top 0.254: J12.2 7.53,11.18 11.18,11.18 J7.2 | C1.+ 17.91,17.91 17.46,17.46 U1.3 15.55,17.46 15.24,17.14 15.24,16.76 14.99,16.51 13.34,16.51 12.7,15.88 12.7,14.1 12.57,13.97 10.92,13.97 10.58,13.63 R1.2 10.58,12.28 J7.2 | F1.1 12.83,10.03 J7.2
VBATT_LVL  (via drill 0.3)
  Top 0.152: R1.1 12.95,13.08 13.59,12.45 R2.2 14.35,12.41 v14.35,10.41 | v33.78,10.41 32.77,10.41 31.91,11.28 31.91,12.83 32.05,12.97 U3.26 | v33.9,7.62 v30.48,7.62
  Bottom 0.152: v30.48,7.62 29,6.14 21.29,6.14 20.32,7.11 20.32,10.92 19.81,11.43 17.91,11.43 17.04,10.57 17.04,9.94 16.73,9.63 14.77,9.63 14.35,10.04 v14.35,10.41 | v33.78,10.41 33.78,7.74 v33.9,7.62

### Text on the board
Bottom: x02
tPlace: + | -
bPlace: + | -
bValues: RFM69 / or / RFM95W
tDocu: Elias Santistevan | Andy England | 0.8mm Board Thickness